# Altium project CoilGunMk3.PrjPcb
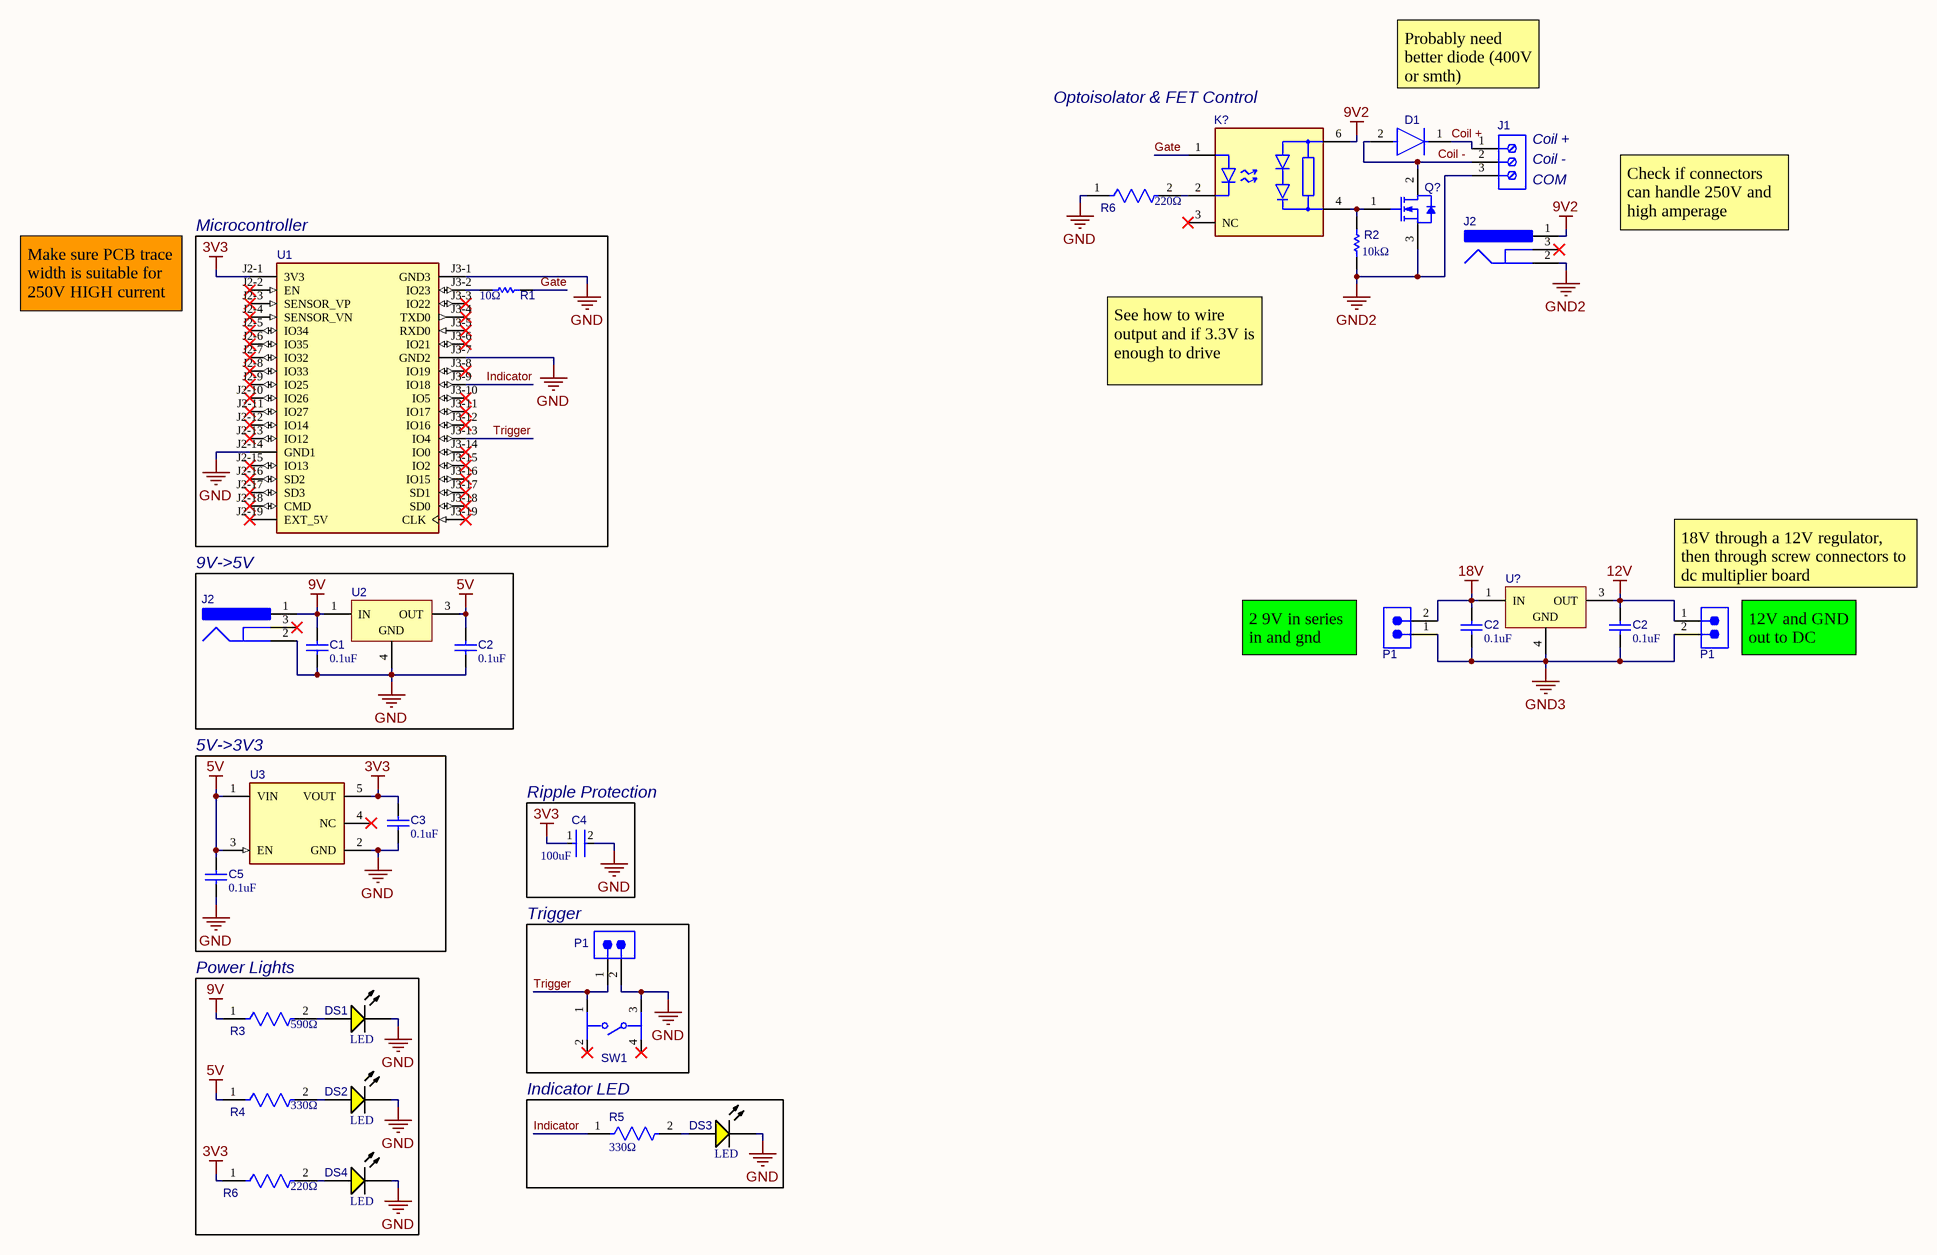
[diagram p0: ControlBoard.SchDoc]
3 sheets, 43 parts. Net scope: global (net labels, ports and power ports of the same name join across sheets).
Board file: ControlBoard.PcbDoc
Sheets:
  ControlBoard.SchDoc
  CapacitorBank.SchDoc
  Blockout.SchDoc

## Sheet ControlBoard.SchDoc
size A0; SheetNumber: 1; SheetTotal: 2

### Parts
(Parts that share a designator on the sheet are numbered #1, #2 ... from top to bottom, then left to right.)
C1  0.1uF  [KEMT-1206-2_M]
C2#1  0.1uF  [KEMT-1206-2_M]
C2#2  0.1uF  [KEMT-1206-2_M]
C2#3  0.1uF  [KEMT-1206-2_M]
C3  0.1uF  [KEMT-1206-2_M]
C4  100uF  [FP-C1206C-EH-MFG]
C5  0.1uF  [KEMT-1206-2_M]
D1  1N4007  [FP-1N4007-MFG]  (value not drawn)
DS1  LED  [LUMX-SML-LX1206YC-TR_V]
DS2  LED  [LUMX-SML-LX1206YC-TR_V]
DS3  LED  [LUMX-SML-LX1206YC-TR_V]
DS4  LED  [LUMX-SML-LX1206YC-TR_V]
J1  691101710003  [691101710003]  (value not drawn)
J2#1  DC Jack  [CUI-PJ-002A_V]  (value not drawn)
J2#2  DC Jack  [CUI-PJ-002A_V]  (value not drawn)
K?  APV1122A  [FP-APV1122A-MFG]  (value not drawn)
P1#1  61300211121  [61300211121]  (value not drawn)
P1#2  61300211121  [61300211121]  (value not drawn)
P1#3  61300211121  [61300211121]  (value not drawn)
Q?  IRFP460PBF  [VISH-TO-247AC-3]  (value not drawn)
R1  10Ω  [RESC3116X65X40ML10T20]
R2  10kΩ  [RESC3116X65X50LL20T20]
R3  590Ω  [FP-CRCW1206-e3-MFG]
R4  330Ω  [FP-CRCW1206-e3-IPC_A]
R5  330Ω  [FP-CRCW1206-e3-IPC_A]
R6#1  220Ω  [FP-RMCF1206-IPC_A]
R6#2  220Ω  [FP-RMCF1206-IPC_A]
SW1  Momentary  [FP-FSM103-MFG]  (value not drawn)
U1  ESP32-DEVKITC-32D  [MODULE_ESP32-DEVKITC-32D]  (value not drawn)
U2  L78M05CDT-TR  [TO-252_L]  (value not drawn)
U3  MIC5504-3.3YM5-TR  [FP-SOT23-5LD-PL-1-MFG]  (value not drawn)
U?  L7812ABD2T-TR  [TO-263_L]  (value not drawn)

### Blocks framed on the sheet
Microcontroller: R1 U1
9V->5V: C1 C2#3 J2#2 U2
5V->3V3: C3 C5 U3
Ripple Protection: C4
Trigger: P1#3 SW1
Power Lights: DS1 DS2 DS4 R3 R4 R6#2
Indicator LED: DS3 R5

### Nets
3V3: C3.1 C4.1 R6#2.1 U1.J2-1(3V3) U3.5(VOUT)
5V: C2#3.1 C5.1 R4.1 U2.3(OUT) U3.1(VIN) U3.3(EN)
9V: C1.1 J2#2.1 R3.1 U2.1(IN)
9V2: J2#1.1 K?.6(+)
12V: C2#2.1 P1#1.1 U?.3(OUT)
18V: C2#1.1 P1#2.2 U?.1(IN)
GND: C1.2 C2#3.2 C3.2 C4.2 C5.2 DS1.2(K) DS2.2(K) DS3.2(K) DS4.2(K) J2#2.2 P1#3.2 R6#1.1 SW1.3 U1.J2-14(GND1) U1.J3-1(GND3) U1.J3-7(GND2) U2.4(GND) U3.2(GND)
GND2: J1.3 J2#1.2 Q?.3(S) R2.1
GND3: C2#1.2 C2#2.2 P1#1.2 P1#2.1 U?.4(GND)
Coil +: D1.1(C) J1.1
Coil -: D1.2(A) J1.2 Q?.2(D)
Gate: K?.1(A) R1.2
Indicator: R5.1 U1.J3-9(IO18)
Trigger: P1#3.1 SW1.1 U1.J3-13(IO4)
NetDS1_1: DS1.1(A) R3.2
NetDS2_1: DS2.1(A) R4.2
NetDS3_1: DS3.1(A) R5.2
NetDS4_1: DS4.1(A) R6#2.2
NetK?_2: K?.2(C) R6#1.2
NetK?_4: K?.4(-) Q?.1(G) R2.2
NetR1_1: R1.1 U1.J3-2(IO23)

Not connected (* = marked no-connect by the designer): J2#1 3*; J2#2 3*; K? 3(NC)*; SW1 2* 4*; U1 J2-2(EN)* J2-3(SENSOR_VP)* J2-4(SENSOR_VN)* J2-5(IO34)* J2-6(IO35)* J2-7(IO32)* J2-8(IO33)* J2-9(IO25)* J2-10(IO26)* J2-11(IO27)* J2-12(IO14)* J2-13(IO12)* J2-15(IO13)* J2-16(SD2)* J2-17(SD3)* J2-18(CMD)* J2-19(EXT_5V)* J3-3(IO22)* J3-4(TXD0)* J3-5(RXD0)* J3-6(IO21)* J3-8(IO19)* J3-10(IO5)* J3-11(IO17)* J3-12(IO16)* J3-14(IO0)* J3-15(IO2)* J3-16(IO15)* J3-17(SD1)* J3-18(SD0)* J3-19(CLK)*; U3 4(NC)*

### Notes on the sheet
- Probably need better diode (400V or smth)
- (near K?) Optoisolator & FET Control
- (near J1) Coil +
- (near J1) Coil -
- COM
- Check if connectors can handle 250V and high amperage
- Make sure PCB trace width is suitable for 250V HIGH current
- See how to wire output and if 3.3V is enough to drive
- (near P1#1) 18V through a 12V regulator, then through screw connectors to dc multiplier board
- 2 9V in series in and gnd
- (near P1#1) 12V and GND out to DC boost board

### Library data of the parts
C1 C2#1-C2#3 C3 C5 = CMP-1037-04202-2: CAP, Ceramic, 0.1 uF, +/- 10%, 50 V, -55 to 125 degC, 1206 (3216 Metric), RoHS, Tape and Reel; Manufacturer: Kemet; Voltage Rating: 50V; Capacitance: 0.1µF; Product Range: KEMET-CSeries; SVHC: ToBeAdvised; Dielectric Characteristic: X7R; Capacitor Case Style: 1206[3216Metric]; Package Reference: 1206-2; Package Description: 2-Leads SMD, Body 3.2 x 1.6 mm; Packaging: Tape&Reel; Operating Temperature Max: 125degC; Capacitance Tolerance: ±10%; Datasheet URL: https://datasheet.ciiva.com/6125/1725438-6125494.pdf; Manufacturer URL: http://www.kemet.com/; Operating Temperature Min: -55degC; Datasheet Version: Jul-13
C4 = CMP-1037-05005-3: CAP CER 100UF 6.3V X5R 1206; Dielectric Material: Ceramic; Tolerance: 2%; Dissipation Factor: 5%; Min Operating Temperature: -55°C; Case Code (Imperial): 1206; Case Code (Metric): 3216; Depth: 1.6mm; Dielectric: X5R; Max Operating Temperature: 85°C; Packaging: Tape and Reel; Construction: Flat; Series: C; Case/Package: 1206; Radiation Hardening: No; Voltage Rating (DC): 6.3V; Termination: SMD/SMT; Voltage Rating: 6.3V; Capacitance: 100uF; Number of Pins: 2; RoHS Compliant: Yes; Height: 1.6mm; Lead Free: Lead Free; Voltage: 6.3V; REACH SVHC: No SVHC; Length: 3.2mm; Mount: Surface Mount; Package Quantity: 1; Thickness: 0.071inch; Width: 0.063inch
D1 = CMP-123542-000001-1: Rectifier diode 1000 V 1 A DO-41, ,; Manufacturer: Diotec; Max Surge Forward Current: 27A; Forward Current: 1A; Max Junction Temp: +175°C; Reverse Voltage: 1000V; Value: 15pF; Peak Reverse Current: 5uA; Category: Diode; Temperature Range Low: -50°C; Automotive: No; Temperature: -50°C to +175°C; Lead Free: Yes; ComponentLink2Description: Datasheet; Max Repetitive Reverse Voltage: 1000V; ComponentLink2URL: https://datasheet.octopart.com/1N4007-Diotec-datasheet-62346875.pdf; Manufacturer Part Number: 1N4007; Device Class L3: Rectifier Diodes; Height: 2.8mm; Octopart: https://octopart.com/1n4007-diotec-4040411; Package: 1N4007; Temperature Range High: +175°C; Device Class L1: Discrete Semiconductors; Device Class L2: Diodes; RoHS: TRUE; Capacitance: 15pF; Ipc Land Pattern Name: DIOAD888W100L520D280
DS1-DS4 = CMP-2000-07124-1: Yellow LED, Water Clear Len, 585 nm, 2.1 V, -40 to 85 degC, 2-Pin SMD, RoHS, Tape and Reel; Manufacturer: Lumex; Product Training Modules: LEDsBenefitsofCustomLEDandLCDTechnology; Millicandela Rating: 6mcd; Catalog Drawings: SML-LX1206SeriesTopSML-LX1206SeriesSideSML-LX1206SeriesBottomSML-LX1206SeriesFootprint; Wavelength - Peak: 585nm; Other Names: 67-1358-2LU60357TRSMLLX1206YCTR; Lens Style/Size: RectanglewithFlatTop; Current - Test: 20mA; Lens Color: Colorless; Viewing Angle: 160°; Voltage - Forward (Vf) (Typ): 2.1V; Online Catalog: SML-LX1206RectanglewithFlatTop1206PackageLEDs; Mounting Type: SurfaceMount; Package Description: 2-Pin Surface Mount Device, Body 3.2 x 1.5 mm; Datasheet Version: Rev. K, 08/2012; Features: -; Color: Yellow; RoHS Information: RoHSCertofCompliance; Package Reference: SML-LX1206YC-TR; Supplier Device Package: 1206; Standard Package: 3,000; Series: -; Wavelength - Dominant: -; Package / Case: 1206(3216Metric); Mounting Technology: SurfaceMount; Height (Max): 1.10mm; Lens Transparency: Clear; Datasheet URL: http://www.lumex.com/content/files/ProductAttachment/SML-LX1206YC-TR.pdf; Family: LEDIndication-Discrete; Manufacturer URL: http://www.lumexinstruments.com/; Packaging: Tape&Reel(TR); Category: Optoelectronics; Size / Dimension: 3.20mmLx1.60mmW
J1 = CMP-1502-03257-2: NexarPartId: 8917705; Voltage Rating: 250V; Current: 16A; Wire Gauge (Min): 14AWG; Pitch: 5.0038mm; Wire Gauge (Max): 26AWG; Number of Positions Per Level: 3; Plating: Steel; Number of Levels: 1; Stripping Length: -7mm; REACH SVHC: Unknown; Width: 16.2mm; Height: 16.4mm; Contact Material: Brass; RoHS: Compliant; Color: Blue; Contact Plating: Tin; Lead Pitch: 5mm; Packaging: Box; Termination: Screw; Number of Contacts: 3; Wire/Cable Gauge: 26AWG; Min Operating Temperature: -40°C; Max Operating Temperature: 105°C; Housing Material: Nylon; Length: 9mm; Voltage: 250V; Mount: Through Hole; Current Rating: 16A; Number of Pins: 3
J2#1 J2#2 = CMP-2000-06895-2: Through Hole Right Angle DC Power Jack, 2.5 A, 2 mm Center Pin, 3 Position, -25 to 85 degC, RoHS, Bulk; Manufacturer: CUIInc.; Brand: CUI; Inside Contact Diameter: 2mm; Voltage Rating: 24V; Outside Contact Diameter: 6.5mm; Current Rating: 2.5A; Insulation Resistance: 50MOhms; Contact Gender: Male; Connector Type: DCPowerJack; Datasheet Version: Rev. 1.03, 04/2016; Housing Material: PolybutyleneTerephthalate(PBT); Operating Temperature Range: -25Cto+85C; Termination Style: ThroughHole; Product Category: DCPowerConnectors; Mounting Technology: ThroughHole; Mounting Style: ThroughHole; Factory Pack Quantity: 500; Contact Plating: Nickel; Package Reference: PJ-002A; Mounting Angle: Right; Package Description: 3-Pin Through Hole Device, Body 14.4 x 9 mm, Height 11 mm; Flammability Rating: UL94V-0; Manufacturer URL: http://www.cui.com/; Product: Jacks; Contact Material: Copper; Datasheet URL: http://www.cui.com/product/resource/pj-002a.pdf; RoHS: True
K? = CMP-00287-00907340-1: APV1122A APV Series 50 mA 5 Vr 75 mW Photovoltaic Mosfet Driver - DIP-6; NexarPartId: 907340; Output Current: 14µA; Max Output Current: 1A; Max Junction Temperature (Tj): 125°C; Max Supply Voltage: 5V; Number of Channels: 1; Input Current: 30mA; Isolation Voltage: 5kV; Max Power Dissipation: 75mW; Capacitance: 800fF; Max Output Voltage: 8.7V; Forward Current: 50mA; Forward Voltage: 1.5V; REACH SVHC: Unknown; RoHS: Compliant; Output Current per Channel: 14µA; Max Operating Temperature: 85°C; Lead Free: Lead Free; Number of Elements: 1; Reverse Voltage (DC): 5V; Ambient Temperature Range High: 85°C; Number of Pins: 6; Min Operating Temperature: -40°C; Reverse Breakdown Voltage: 5V; Schedule B: 8541408000, 8541408000; Power Dissipation: 75mW; Output Voltage: 8.7V; Height: 4.1mm; Number of Contacts: 1; Case/Package: SMD/SMT; Mount: Surface Mount
P1#1-P1#3 = CMP-1712-00002-6: NexarPartId: 20081794; Number of Contacts: 2; Pitch: 2.54mm; Connector Type: Male Pin; Voltage Rating: 250V; Current Rating: 3A; Gender: Male; Contact Resistance: 20mΩ; Height: 8.94mm; Lead Free: Lead Free; Number of Pins: 2; Termination: Through Hole; RoHS: Compliant; Lead Pitch: 2.54mm; REACH SVHC: No SVHC; Housing Material: PBT; Contact Mating Length: 5.9944mm; Min Operating Temperature: -40°C; Orientation: Vertical; Contact Material: Copper; Contact Gender: Male; Max Operating Temperature: 125°C; Number of Rows: 1; Number of Positions: 2; Packaging: Bulk; Contact Plating: Gold; Mount: Through Hole; Color: Black; Operating Supply Voltage: 250V
Q? = CMP-2000-06478-1: N-Channel Power MOSFET, 500 V, -55 to 150 degC, 3-Pin FM (TO-247), RoHS, Tube; Manufacturer: Vishay; Drain Source Voltage Vds: 500V; No. of Pins: 3Pins; On Resistance Rds(on): 0.27ohm; Transistor Polarity: NChannel; Power Dissipation Pd: 280W; Threshold Voltage Vgs: 4V; Transistor Case Style: TO-247AC; Continuous Drain Current Id: 20A; Rds(on) Test Voltage Vgs: 10V; SVHC: ToBeAdvised; Mounting Technology: ThroughHole; Automotive Qualification Standard: -; Datasheet Version: Rev. A, 07/2008; Package Reference: TO-247AC-3; Package Description: 3-Pin Flange Mount Package, Body 15.58 x 4.945 mm, Pitch 5.46 mm; Operating Temperature Max: 150°C; Product Range: -; Manufacturer URL: http://www.vishay.com/; MSL: -; Datasheet URL: https://datasheet.ciiva.com/17070/0900766b8079122f-17070730.pdf
R1 = CMP-2100-03677-1: Chip Resistor, 10 Ohm, +/- 1%, 0.25 W, -55 to 155 degC, 1206 (3216 Metric), RoHS, Tape and Reel; Manufacturer: Yageo; Voltage Rating (DC): 200V; Resistance: 10Ohm; Power Rating: 250mW; Temperature Coefficient: 200ppm/degreesC; Military Standard: Not; Package Description: 2-Pin Surface Mount Device, Body 3.1 x 1.6 mm; Packaging: TapeandReel; Datasheet Version: Rev. 5, 10/2016; Length: 3.1mm; Manufacturer URL: http://www.yageo.com/; Voltage Rating: 200V; Height: 0.026inch; REACH SVHC: Unknown; Max Operating Temperature: 155degC; Case Code (Imperial): 1206; Package Reference: 1206.0; RoHSCompliant: true; Termination: SMD/SMT; Lead Free: LeadFree; Composition: ThickFilm; Tolerance: 1%; Package Quantity: 1; Min Operating Temperature: -55degC; Datasheet URL: http://www.yageo.com/NewPortal/yageodocoutput?fileName=/pdf/R-Chip/PYu-RC_Group_51_RoHS_L_5.pdf; Number of Pins: 2; Width: 0.063inch; Case Code (Metric): 3216; Max Power Dissipation: 250mW; Depth: 1.6mm; Number of Terminations: 2; Case/Package: 1206
R2 = CMP-2003-04880-1: Part Number: CRCW12061K00JNEAHP; Manufacturer: Vishay Dale
R3 = CMP-2003-02292-2: RES Thick Film, 590Ω, 1%, 0.25W, 100ppm/°C, 1206; Max Power Dissipation: 250mW; Voltage Rating: 200V; Resistance: 590R; Max Operating Temperature: 155°C; Number of Pins: 2; Case Code (Imperial): 1206; Power Rating: 250mW; Composition: Thick Film; Tolerance: 1%; Voltage Rating (DC): 200V; Length: 3.2mm; Packaging: Tape and Reel; Termination: SMD/SMT; Lead Free: Lead Free; Military Standard: Not; Features: Automotive AEC-Q200; Weight: 0.000353oz; Width: 0.063inch; Height: 0.024inch; Case Code (Metric): 3216; Temperature Coefficient: 100ppm/°C; Case/Package: 1206; Package Quantity: 10; Number of Terminations: 2; Contact Plating: Tin; Radiation Hardening: No; Depth: 1.6mm; Min Operating Temperature: -55°C
R4 R5 = CMP-2003-02098-2: RES Thick Film, 330Ω, 1%, 0.25W, 100ppm/°C, 1206; Voltage Rating: 200V; Resistance: 330R; Max Power Dissipation: 250mW; Height: 0.55mm; Mount: Surface Mount; Min Operating Temperature: -55°C; Depth: 1.6mm; Features: Automotive AEC-Q200; Voltage Rating (DC): 200V; Military Standard: Not; Packaging: Tape and Reel; Composition: Thick Film; Contact Plating: Tin; Case Code (Imperial): 1206; Case/Package: 1206; Number of Terminations: 2; Length: 3.2mm; Lead Free: Lead Free; Tolerance: 1%; Temperature Coefficient: 100ppm/°C; Case Code (Metric): 3216; Width: 1.6mm; Weight: 0.000353oz; Termination: SMD/SMT; Radiation Hardening: No; Package Quantity: 10; Power Rating: 250mW; Max Operating Temperature: 155°C
R6#1 R6#2 = CMP-26527-004145-1: 220Ω ±5% 0.25W 1206 Thick Film Chip Resistor AEC-Q200 compliant; Max Power Dissipation: 250mW; Resistance: 220R; Temperature Coefficient: 200ppm/°C; Series: RMCF; Mount: Surface Mount; Construction: Rectangular; Packaging: Tape and Reel; Contact Plating: Tin; Military Standard: Not; Min Operating Temperature: -55°C; Resistor Type: Thick Film; Features: Automotive AEC-Q200; Case Code (Metric): 3216; Case/Package: 1206; Depth: 1.6mm; Tolerance: 5%; Case Code (Imperial): 1206; Height: 0.028inch; Length: 0.126inch; Size Code: 1206; Lead Free: Lead Free; Radiation Hardening: No; Power Rating: 250mW; Width: 0.063inch; RoHS Compliant: Yes; Max Operating Temperature: 155°C; Number of Terminations: 2
SW1 = CMP-03407-000037-1: SWITCH TACTILE SPST-NO 0.05A 24V; Contact Resistance: 100mR; Actuator Length: 3.4mm; Switch Function: Off-Mom; Operating Force: 1.57N; Illumination Type: Non-Illuminated; Voltage Rating (DC): 12V; Current Rating: 50mA; Actuator Material: Polyester; Switch Travel: 0.3mm; Throw Configuration: SPST; Actuator Color: Black; Mechanical Life: 100000Cycles; Depth: 14.1mm; RoHS Compliant: Yes; Max Operating Temperature: 85°C; Mount: Through Hole; Min Operating Temperature: -35°C; Contact Plating: Silver; Width: 12mm; Package Quantity: 400; Radiation Hardening: No; Series: FSM100 ~ 104; Type: Switch; Termination: PC Pins; Voltage Rating: 24V; Contact Material: Brass; Max Voltage Rating (DC): 12V; Contact Current Rating: 50mA; Length: 12mm; Packaging: Loose Piece; Orientation: Straight; Max Current Rating: 50mA; Electrical Life: 100000Cycles
U1 = CMP-039-000000-A.1: WiFi Development Tools (802.11) ESP32 General Development Kit, ESP32-WROOM-32D on the board; MF: Espressif Systems; Check_prices: https://www.snapeda.com/parts/ESP32-DEVKITC-32D/Espressif+Systems/view-part/?ref=eda; SnapEDA_Link: https://www.snapeda.com/parts/ESP32-DEVKITC-32D/Espressif+Systems/view-part/?ref=snap; Package: None; Component Type: Standard; Value: *; Pin Count: 38; Source: ESP32-DEVKITC-32D.SchLib; MP: ESP32-DEVKITC-32D; Design Item ID: ESP32-DEVKITC-32D
U2 = CMP-0244-00178-1: Positive Voltage Regulator, 5V, 3-Pin DPAK, Tape and Reel; PackageReference: TO-252; ComponentLink1URL: http://www.st.com; ComponentLink2Description: Datasheet; PackageDescription: 3-Pin Transistor Outline Package 2.28 mm Pitch, 9.7 mm Lead Span (DPAK); ComponentLink1Description: Manufacturer URL; DatasheetVersion: 1/11/2010; ComponentLink2URL: http://www.st.com/internet/com/TECHNICAL_RESOURCES/TECHNICAL_LITERATURE/DATASHEET/CD00000447.pdf; PackageVersion: 2011
U3 = CMP-2000-07604-2: IC REG LINEAR 3.3V 300MA SOT23-5; Quiescent Current: 38uA; Operating Supply Current: 42uA; Max Input Voltage: 5.5V; Min Input Voltage: 2.5V; Output Type: Fixed; Power Supply Rejection Ratio (PSRR): 60dB; Dropout Voltage: 380mV; Accuracy: 3%; Number of Outputs: 1; Nominal Output Voltage: 3.3V; Max Output Current: 300mA; Length: 2.9mm; Mount: Surface Mount; Width: 1.6mm; Packaging: Tape and Reel; Output Current: 300mA; Min Operating Temperature: -40°C; Max Operating Temperature: 125°C; Height: 1.1mm; Case/Package: SOT-23-5; REACH SVHC: No SVHC; Number of Pins: 5; Output Voltage: 3.3V
U? = CMP-0244-00181-1: Positive Voltage Regulator, 3-Pin D2PAK, Tape and Reel; ComponentLink1Description: Manufacturer URL; ComponentLink2URL: http://www.st.com/internet/com/TECHNICAL_RESOURCES/TECHNICAL_LITERATURE/DATASHEET/CD00000444.pdf; PackageVersion: 2011; PackageDescription: 3-Pin Transistor Outline Package 2.54 mm Pitch, 15.4 mm Lead Span (D2PAK); DatasheetVersion: 16/11/2011; PackageReference: TO-263; ComponentLink1URL: http://www.st.com; ComponentLink2Description: Datasheet

## Sheet CapacitorBank.SchDoc
size A0; SheetNumber: 2; SheetTotal: 2
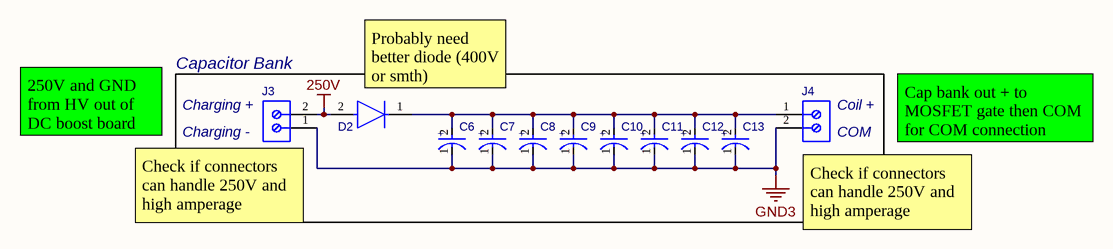
[diagram p1: CapacitorBank.SchDoc]

### Parts
C6  450VXH150MEFCSN25X30  [FP-VXH25X30-MFG]  (value not drawn)
C7  450VXH150MEFCSN25X30  [FP-VXH25X30-MFG]  (value not drawn)
C8  450VXH150MEFCSN25X30  [FP-VXH25X30-MFG]  (value not drawn)
C9  450VXH150MEFCSN25X30  [FP-VXH25X30-MFG]  (value not drawn)
C10  450VXH150MEFCSN25X30  [FP-VXH25X30-MFG]  (value not drawn)
C11  450VXH150MEFCSN25X30  [FP-VXH25X30-MFG]  (value not drawn)
C12  450VXH150MEFCSN25X30  [FP-VXH25X30-MFG]  (value not drawn)
C13  450VXH150MEFCSN25X30  [FP-VXH25X30-MFG]  (value not drawn)
D2  1N4007  [FP-1N4007-MFG]  (value not drawn)
J3  691102710002  [691102710002]  (value not drawn)
J4  691102710002  [691102710002]  (value not drawn)

### Nets
250V: D2.2(A) J3.2
GND3: C6.1(C) C7.1(C) C8.1(C) C9.1(C) C10.1(C) C11.1(C) C12.1(C) C13.1(C) J3.1 J4.2
NetC6_2: C6.2(A) C7.2(A) C8.2(A) C9.2(A) C10.2(A) C11.2(A) C12.2(A) C13.2(A) D2.1(C) J4.1

### Notes on the sheet
- (near J3) Capacitor Bank
- (near D2) Probably need better diode (400V or smth)
- 250V and GND from HV out of DC boost board
- (near J3) Charging +
- (near J3) Charging -
- (near J4) Coil +
- (near J4) COM
- Cap bank out + to MOSFET gate then COM for COM connection
- (near J3) Check if connectors can handle 250V and high amperage
- (near J4) Check if connectors can handle 250V and high amperage
- (in symbol CMP-01474-28338259-1) +

### Library data of the parts
C6-C13 = CMP-01474-28338259-1: 450VXH150MEFCSN25X30 Cap Alum 150UF 20% 450V Snap; Life (Hours): 5000hours; Leakage Current: 779.42µA; Ripple Current: 1.12A; Capacitance: 150µF; Polarity: Polar; Min Operating Temperature: -25°C; Lead Pitch: 10.0076mm; Dissipation Factor: 20%; Voltage Rating: 450V; Tolerance: 20%; Height: 32mm; NexarPartId: 28338259; Max Operating Temperature: 105°C; Mount: Through Hole; Packaging: Bulk; Case/Package: Radial; Height - Seated (Max): 32.004mm; RoHS: Compliant
D2 = CMP-123542-000001-1: as D1 on sheet ControlBoard; Category: Diode; Temperature Range Low: -50°C; Automotive: No; Temperature: -50°C to +175°C; Lead Free: Yes; ComponentLink2Description: Datasheet; Max Repetitive Reverse Voltage: 1000V; ComponentLink2URL: https://datasheet.octopart.com/1N4007-Diotec-datasheet-62346875.pdf; Manufacturer Part Number: 1N4007; Device Class L3: Rectifier Diodes; Height: 2.8mm; Octopart: https://octopart.com/1n4007-diotec-4040411; Package: 1N4007; Temperature Range High: +175°C; Device Class L1: Discrete Semiconductors; Device Class L2: Diodes; RoHS: TRUE; Capacitance: 15pF; Ipc Land Pattern Name: DIOAD888W100L520D280
J3 J4 = CMP-1502-03258-2: NexarPartId: 8917706; Number of Levels: 1; Number of Positions Per Level: 2; Current: 15A; Voltage: 300V; Pitch: 5.0038mm; Plating: Steel; Stripping Length: -6mm; Wire Gauge (Min): 14AWG; Wire Gauge (Max): 22AWG; Length: 7.5mm; Contact Material: Brass; Contact Plating: Tin; Packaging: Box; Number of Pins: 2; Voltage Rating: 300V; Termination: Screw; Number of Contacts: 2; Color: Blue; Current Rating: 15A; Mount: Through Hole; Max Operating Temperature: 105°C; Min Operating Temperature: -40°C; REACH SVHC: Unknown; Height: 13.4mm; Width: 11.2mm; Housing Material: Nylon; RoHS: Compliant; Wire/Cable Gauge: 22AWG; Lead Pitch: 5mm

## Sheet Blockout.SchDoc
size A0; SheetNumber: 3; SheetTotal: 3
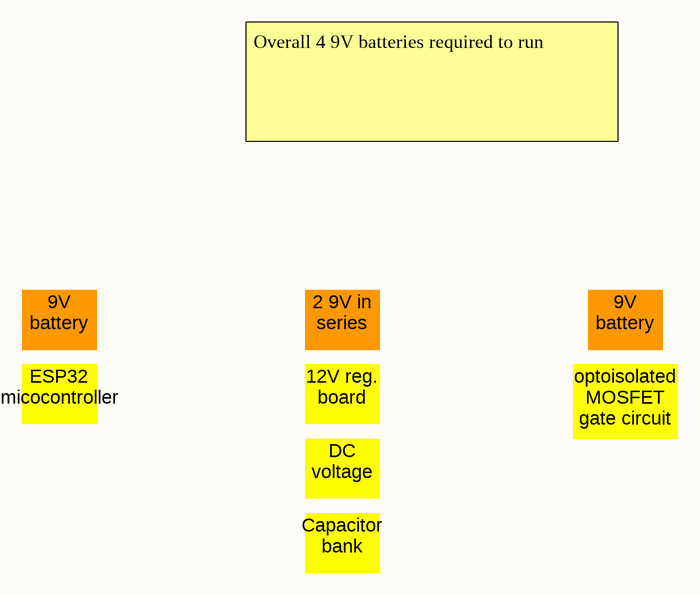
[diagram p2: Blockout.SchDoc]

### Notes on the sheet
- Overall 4 9V batteries required to run
- 9V battery
- 2 9V in series
- ESP32 micocontroller power
- 12V reg. board
- optoisolated MOSFET gate circuit
- DC voltage board
- Capacitor bank

## Nets that join several sheets
GND3: ControlBoard (5 pins), CapacitorBank (10 pins)